# EAGLE design Bodenplatine v001 (EAGLE 7.2.0)
AUTHOR: Stefan Müller; PROJEKTNAME: xMZ-Mod-Touch-Bodenplatine; VERSION: 0.0.1
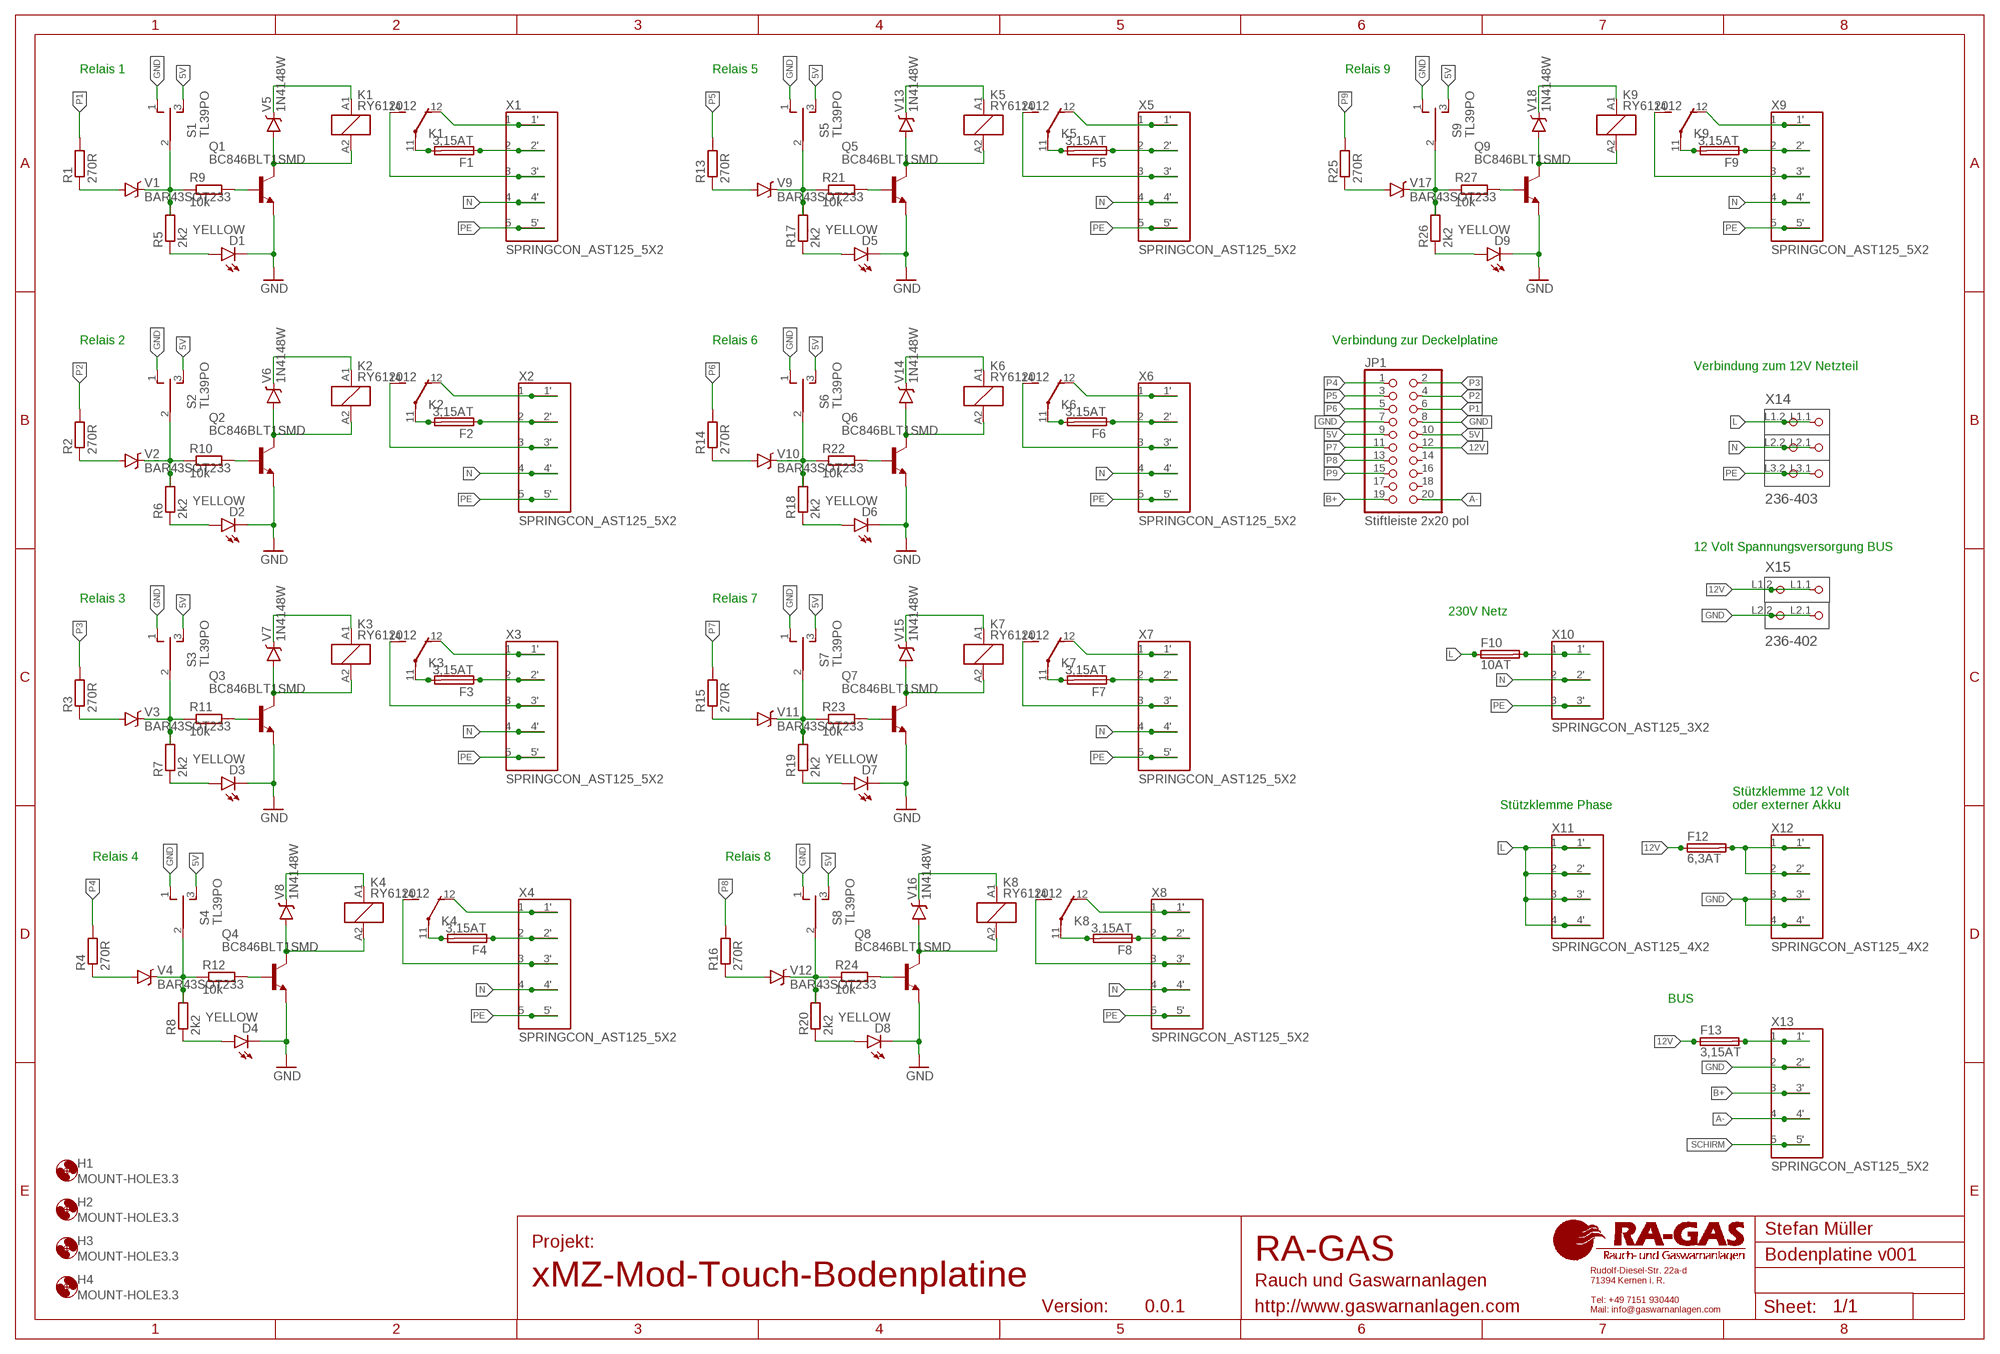
[diagram p0: schematic, sheet 1]

## Parts
D1  YELLOW  LED-YELLOWLARGE  [LED-1206]
D2  YELLOW  LED-YELLOWLARGE  [LED-1206]
D3  YELLOW  LED-YELLOWLARGE  [LED-1206]
D4  YELLOW  LED-YELLOWLARGE  [LED-1206]
D5  YELLOW  LED-YELLOWLARGE  [LED-1206]
D6  YELLOW  LED-YELLOWLARGE  [LED-1206]
D7  YELLOW  LED-YELLOWLARGE  [LED-1206]
D8  YELLOW  LED-YELLOWLARGE  [LED-1206]
D9  YELLOW  LED-YELLOWLARGE  [LED-1206]
F1  3,15AT  FPG4  [FPG4]
F2  3,15AT  FPG4  [FPG4]
F3  3,15AT  FPG4  [FPG4]
F4  3,15AT  FPG4  [FPG4]
F5  3,15AT  FPG4  [FPG4]
F6  3,15AT  FPG4  [FPG4]
F7  3,15AT  FPG4  [FPG4]
F8  3,15AT  FPG4  [FPG4]
F9  3,15AT  FPG4  [FPG4]
F10  10AT  FPG4  [FPG4]
F12  6,3AT  FPG4  [FPG4]
F13  3,15AT  FPG4  [FPG4]
H1  MOUNT-HOLE3.3  [3,3]
H2  MOUNT-HOLE3.3  [3,3]
H3  MOUNT-HOLE3.3  [3,3]
H4  MOUNT-HOLE3.3  [3,3]
JP1  Stiftleiste 2x20 pol  PINHD-2X10  [2X10]
K1  RY612012  [RY-II]
K2  RY612012  [RY-II]
K3  RY612012  [RY-II]
K4  RY612012  [RY-II]
K5  RY612012  [RY-II]
K6  RY612012  [RY-II]
K7  RY612012  [RY-II]
K8  RY612012  [RY-II]
K9  RY612012  [RY-II]
Q1  BC846BLT1SMD  [SOT23]
Q2  BC846BLT1SMD  [SOT23]
Q3  BC846BLT1SMD  [SOT23]
Q4  BC846BLT1SMD  [SOT23]
Q5  BC846BLT1SMD  [SOT23]
Q6  BC846BLT1SMD  [SOT23]
Q7  BC846BLT1SMD  [SOT23]
Q8  BC846BLT1SMD  [SOT23]
Q9  BC846BLT1SMD  [SOT23]
R1  270R  R-EU_M0805  [M0805]
R2  270R  R-EU_M0805  [M0805]
R3  270R  R-EU_M0805  [M0805]
R4  270R  R-EU_M0805  [M0805]
R5  2k2  R-EU_R0603  [R0603]
R6  2k2  R-EU_R0603  [R0603]
R7  2k2  R-EU_R0603  [R0603]
R8  2k2  R-EU_R0603  [R0603]
R9  10k  R-EU_R0603  [R0603]
R10  10k  R-EU_R0603  [R0603]
R11  10k  R-EU_R0603  [R0603]
R12  10k  R-EU_R0603  [R0603]
R13  270R  R-EU_M0805  [M0805]
R14  270R  R-EU_M0805  [M0805]
R15  270R  R-EU_M0805  [M0805]
R16  270R  R-EU_M0805  [M0805]
R17  2k2  R-EU_R0603  [R0603]
R18  2k2  R-EU_R0603  [R0603]
R19  2k2  R-EU_R0603  [R0603]
R20  2k2  R-EU_R0603  [R0603]
R21  10k  R-EU_R0603  [R0603]
R22  10k  R-EU_R0603  [R0603]
R23  10k  R-EU_R0603  [R0603]
R24  10k  R-EU_R0603  [R0603]
R25  270R  R-EU_M0805  [M0805]
R26  2k2  R-EU_R0603  [R0603]
R27  10k  R-EU_R0603  [R0603]
S1  TL39PO  [TL3XPO]
S2  TL39PO  [TL3XPO]
S3  TL39PO  [TL3XPO]
S4  TL39PO  [TL3XPO]
S5  TL39PO  [TL3XPO]
S6  TL39PO  [TL3XPO]
S7  TL39PO  [TL3XPO]
S8  TL39PO  [TL3XPO]
S9  TL39PO  [TL3XPO]
V1  BAR43SOT233  [SOT23]
V2  BAR43SOT233  [SOT23]
V3  BAR43SOT233  [SOT23]
V4  BAR43SOT233  [SOT23]
V5  1N4148W  LL4148  [MINIMELF]
V6  1N4148W  LL4148  [MINIMELF]
V7  1N4148W  LL4148  [MINIMELF]
V8  1N4148W  LL4148  [MINIMELF]
V9  BAR43SOT233  [SOT23]
V10  BAR43SOT233  [SOT23]
V11  BAR43SOT233  [SOT23]
V12  BAR43SOT233  [SOT23]
V13  1N4148W  LL4148  [MINIMELF]
V14  1N4148W  LL4148  [MINIMELF]
V15  1N4148W  LL4148  [MINIMELF]
V16  1N4148W  LL4148  [MINIMELF]
V17  BAR43SOT233  [SOT23]
V18  1N4148W  LL4148  [MINIMELF]
X1  SPRINGCON_AST125_5X2  [SPRINGCON_AST125_5X2]
X2  SPRINGCON_AST125_5X2  [SPRINGCON_AST125_5X2]
X3  SPRINGCON_AST125_5X2  [SPRINGCON_AST125_5X2]
X4  SPRINGCON_AST125_5X2  [SPRINGCON_AST125_5X2]
X5  SPRINGCON_AST125_5X2  [SPRINGCON_AST125_5X2]
X6  SPRINGCON_AST125_5X2  [SPRINGCON_AST125_5X2]
X7  SPRINGCON_AST125_5X2  [SPRINGCON_AST125_5X2]
X8  SPRINGCON_AST125_5X2  [SPRINGCON_AST125_5X2]
X9  SPRINGCON_AST125_5X2  [SPRINGCON_AST125_5X2]
X10  SPRINGCON_AST125_3X2  [SPRINGCON_AST125_3X2]
X11  SPRINGCON_AST125_4X2  [SPRINGCON_AST125_4X2]
X12  SPRINGCON_AST125_4X2  [SPRINGCON_AST125_4X2]
X13  SPRINGCON_AST125_5X2  [SPRINGCON_AST125_5X2]
X14  236-403  [P-236-403]
X15  236-402  [P-236-402]

## Nets
5V: JP1.9 JP1.10 S1.3(S) S2.3(S) S3.3(S) S4.3(S) S5.3(S) S6.3(S) S7.3(S) S8.3(S) S9.3(S)
12V: F12.1 F12.1' F13.1 F13.1' JP1.12 X15.L1.1(P1.1) X15.L1.2(P1.2)
A-: JP1.20 X13.4 X13.4'
B+: JP1.19 X13.3 X13.3'
GND: D1.C D2.C D3.C D4.C D5.C D6.C D7.C D8.C D9.C JP1.7 JP1.8 Q1.2(E) Q2.2(E) Q3.2(E) Q4.2(E) Q5.2(E) Q6.2(E) Q7.2(E) Q8.2(E) Q9.2(E) S1.1(O) S2.1(O) S3.1(O) S4.1(O) S5.1(O) S6.1(O) S7.1(O) S8.1(O) S9.1(O) X12.3 X12.3' X12.4 X12.4' X13.2 X13.2' X15.L2.1(P2.1) X15.L2.2(P2.2)
L: F10.1 F10.1' X11.1 X11.1' X11.2 X11.2' X11.3 X11.3' X11.4 X11.4' X14.L1.1(P1.1) X14.L1.2(P1.2)
N: X1.4 X1.4' X2.4 X2.4' X3.4 X3.4' X4.4 X4.4' X5.4 X5.4' X6.4 X6.4' X7.4 X7.4' X8.4 X8.4' X9.4 X9.4' X10.2 X10.2' X14.L2.1(P2.1) X14.L2.2(P2.2)
N$1: F2.1 F2.1' X2.2 X2.2'
N$2: K2.14(2:S) X2.3 X2.3'
N$3: F2.2 F2.2' K2.11(2:P)
N$4: K2.12(2:O) X2.1 X2.1'
N$5: K2.A2 Q2.3(C) V6.A
N$6: K3.14(2:S) X3.3 X3.3'
N$7: R2.1 V2.1(A)
N$8: R6.2 R10.1 S2.2(P) V2.3(C)
N$9: D2.A R6.1
N$10: Q2.1(B) R10.2
N$11: K2.A1 V6.C
N$12: F3.2 F3.2' K3.11(2:P)
N$13: R3.1 V3.1(A)
N$14: R7.2 R11.1 S3.2(P) V3.3(C)
N$15: D3.A R7.1
N$16: Q3.1(B) R11.2
N$17: K3.A1 V7.C
N$18: K3.A2 Q3.3(C) V7.A
N$19: F3.1 F3.1' X3.2 X3.2'
N$20: K3.12(2:O) X3.1 X3.1'
N$21: K4.14(2:S) X4.3 X4.3'
N$22: F4.2 F4.2' K4.11(2:P)
N$23: R4.1 V4.1(A)
N$24: R8.2 R12.1 S4.2(P) V4.3(C)
N$25: D4.A R8.1
N$26: Q4.1(B) R12.2
N$27: K4.A1 V8.C
N$28: K4.A2 Q4.3(C) V8.A
N$29: F4.1 F4.1' X4.2 X4.2'
N$30: K4.12(2:O) X4.1 X4.1'
N$31: K5.14(2:S) X5.3 X5.3'
N$32: F5.2 F5.2' K5.11(2:P)
N$33: R13.1 V9.1(A)
N$34: R17.2 R21.1 S5.2(P) V9.3(C)
N$35: D5.A R17.1
N$36: Q5.1(B) R21.2
N$37: K5.A1 V13.C
N$38: K5.A2 Q5.3(C) V13.A
N$39: F5.1 F5.1' X5.2 X5.2'
N$40: K5.12(2:O) X5.1 X5.1'
N$41: K6.14(2:S) X6.3 X6.3'
N$42: F6.2 F6.2' K6.11(2:P)
N$43: R14.1 V10.1(A)
N$44: R18.2 R22.1 S6.2(P) V10.3(C)
N$45: D6.A R18.1
N$46: Q6.1(B) R22.2
N$47: K6.A1 V14.C
N$48: K6.A2 Q6.3(C) V14.A
N$49: F6.1 F6.1' X6.2 X6.2'
N$50: K6.12(2:O) X6.1 X6.1'
N$51: K7.14(2:S) X7.3 X7.3'
N$52: F7.2 F7.2' K7.11(2:P)
N$53: R15.1 V11.1(A)
N$54: R19.2 R23.1 S7.2(P) V11.3(C)
N$55: D7.A R19.1
N$56: Q7.1(B) R23.2
N$57: K7.A1 V15.C
N$58: K7.A2 Q7.3(C) V15.A
N$59: F7.1 F7.1' X7.2 X7.2'
N$60: K7.12(2:O) X7.1 X7.1'
N$61: K8.14(2:S) X8.3 X8.3'
N$62: F8.2 F8.2' K8.11(2:P)
N$63: R16.1 V12.1(A)
N$64: R20.2 R24.1 S8.2(P) V12.3(C)
N$65: D8.A R20.1
N$66: Q8.1(B) R24.2
N$67: K8.A1 V16.C
N$68: K8.A2 Q8.3(C) V16.A
N$69: F8.1 F8.1' X8.2 X8.2'
N$70: K8.12(2:O) X8.1 X8.1'
N$71: K9.14(2:S) X9.3 X9.3'
N$72: F9.2 F9.2' K9.11(2:P)
N$73: R25.1 V17.1(A)
N$74: R26.2 R27.1 S9.2(P) V17.3(C)
N$75: D9.A R26.1
N$76: Q9.1(B) R27.2
N$77: K9.A1 V18.C
N$78: K9.A2 Q9.3(C) V18.A
N$79: F9.1 F9.1' X9.2 X9.2'
N$80: K9.12(2:O) X9.1 X9.1'
N$81: K1.14(2:S) X1.3 X1.3'
N$82: F1.2 F1.2' K1.11(2:P)
N$83: R1.1 V1.1(A)
N$84: R5.2 R9.1 S1.2(P) V1.3(C)
N$85: D1.A R5.1
N$86: Q1.1(B) R9.2
N$87: K1.A1 V5.C
N$88: K1.A2 Q1.3(C) V5.A
N$89: F1.1 F1.1' X1.2 X1.2'
N$90: K1.12(2:O) X1.1 X1.1'
N$91: F10.2 F10.2' X10.1 X10.1'
N$92: F13.2 F13.2' X13.1 X13.1'
N$94: F12.2 F12.2' X12.1 X12.1' X12.2 X12.2'
P1: JP1.6 R1.2
P2: JP1.4 R2.2
P3: JP1.2 R3.2
P4: JP1.1 R4.2
P5: JP1.3 R13.2
P6: JP1.5 R14.2
P7: JP1.11 R15.2
P8: JP1.13 R16.2
P9: JP1.15 R25.2
PE: X1.5 X1.5' X2.5 X2.5' X3.5 X3.5' X4.5 X4.5' X5.5 X5.5' X6.5 X6.5' X7.5 X7.5' X8.5 X8.5' X9.5 X9.5' X10.3 X10.3' X14.L3.1(P3.1) X14.L3.2(P3.2)
SCHIRM: X13.5 X13.5'
Unconnected: JP1.14 JP1.16 JP1.17 JP1.18

## Notes on the sheet
- Relais 1 | Relais 5 | Relais 9
- Relais 2 | Relais 6 | Verbindung zur Deckelplatine
- Verbindung zum 12V Netzteil
- 12 Volt Spannungsversorgung BUS
- Relais 3 | Relais 7
- 230V Netz
- Stützklemme Phase
- Stützklemme 12 Volt
  oder externer Akku
- Relais 4 | Relais 8
- BUS

## Library data of the parts
D1-D9 = xMZ-Mod-Touch-Bodenplatine:LED-YELLOW: Yellow SMD LEDs LilyPad 1206- DIO-09909 0603- DIO-09003 "SMART" means more efficient and expensive; MF: KINGBRIGHT; MPN: KP-3216SYC; OC_FARNELL: 8529990; PROD_ID: DIO-00820
F1-F10 F12 F13 = xMZ-Mod-Touch-Bodenplatine:FPG4: PL FPG4-40 :: Sicherungshalter, 5x20mm, max. 10A-250V http://www.reichelt.de/PL-FPG4-40/3/index.html?&ACTION=3&LA=446&ARTICLE=35193&artnr=PL+FPG4-40&SEARCH=PL+FPG+4-40 Datenblatt <http://www.reichelt.de/index.html?&ACTION=7&LA=3&OPEN=0&INDEX=0&FILENAME=C400%252FPL_PFG_4-40.pdf>; OC_FARNELL: unknown; REICHELT: PL+FPG4-40
H1-H4 = holes:MOUNT-HOLE: MOUNTING HOLE with drill center marker; OC_FARNELL: unknown
JP1 = pinhead:PINHD-2X10: PIN HEADER; MF: TE CONNECTIVITY / AMP; MPN: 825440-5; OC_FARNELL: 3417773
K1-K9 = xMZ-Mod-Touch-Bodenplatine:RY?1*: Miniature Power PCB Relay SCHRACK 1 pole 8 A Source: http://www.schrack.com/.. 5817.pdf; MF: TE CONNECTIVITY / SCHRACK; MPN: V23061B1005A301; OC_FARNELL: 1023958; OC_NEWARK: 96B4867
Q1-Q9 = xMZ-Mod-Touch-Bodenplatine:BC846*: NPN Transistor; MF: ON SEMICONDUCTOR; MPN: BC846BWT1G; OC_FARNELL: 2317836
R1-R4 R13-R16 R25 = rcl:R-EU_: RESISTOR, European symbol; MF: MULTICOMP; MPN: MC01W08055270R; OC_FARNELL: 9334254
R5-R8 R17-R20 R26 = rcl:R-EU_: RESISTOR, European symbol; MF: MULTICOMP; MPN: MC0063W060352K2; OC_FARNELL: 9331913
R9-R12 R21-R24 R27 = rcl:R-EU_: RESISTOR, European symbol; MF: TE CONNECTIVITY / NEOHM; MPN: CPF0603B10KE1; OC_FARNELL: 1697388
S1-S9 = xMZ-Mod-Touch-Bodenplatine:TL39PO: TINY SWITCH ON OFF ON Source: http://www2.produktinfo.conrad.com/datenblaetter/700000-724999/705152-da-01-de-Subminiaturschalter_TL_36YO.pdf; MF: TE CONNECTIVITY / ALCOSWITCH; MPN: A103SYCQ04; OC_FARNELL: 1818222
V1-V4 V9-V12 V17 = xMZ-Mod-Touch-Bodenplatine:BAR43: FAIRCHILD SEMICONDUCTOR BAR43 Kleinsignal-Schottky-Diode, Einfach, 30 V, 200 mA, 800 mV, 750 mA, 150 °C Supplier http://de.farnell.com <http://de.farnell.com/fairchild-semiconductor/bar43/schottky-diode-30v-sot-23-3/dp/2453275?ost=2453275&selectedCategoryId=&categoryName=Alle+Kategorien&categoryNameResp=Alle+Kategorien> Datasheet <http://www.farnell.com/datasheets/1963228.pdf> Order Number Supplier 2453275 Farnell; MF: FAIRCHILD SEMICONDUCTOR; MPN: BAR43
V5-V8 V13-V16 V18 = xMZ-Mod-Touch-Bodenplatine:LL4148: VISHAY LL4148-GS08 Kleinsignaldiode, Einfach, 100 V, 150 mA, 1 V, 8 ns, 2 A Datasheet <http://www.farnell.com/datasheets/1353494.pdf> Order Number Supplier 1469399 Farnell 9549986 Farnell 2409162 Farnell 9549986RL Farnell 1469399RL Farnell; MF: VISHAY; MPN: LL4148-GS08; OC_FARNELL: 9549986
X1-X9 X13 = xMZ-Mod-Touch-Bodenplatine:SPRINGCON_AST125_5X2; OC_FARNELL: unknown
X10 = xMZ-Mod-Touch-Bodenplatine:SPRINGCON_AST125_3X2; OC_FARNELL: unknown
X11 X12 = xMZ-Mod-Touch-Bodenplatine:SPRINGCON_AST125_4X2; OC_FARNELL: unknown
X14 = xMZ-Mod-Touch-Bodenplatine:236-403: Serie 236, Klemmenleiste für Leiterplatten 2 Lötstifte/Pol / Series 236, PCB terminal strip 2 solder pins/pole Polzahl / Pole No.: 3 Rastermaß / Pitch: 5 - 5.08 mm Bemessungsspannung / Rated Voltage: 320 V Nennstrom / Nominal Current: 24 A Leiterquerschnitt / Conductor Size: 0.08 - 2.5 mm2 Anschlusstechnik / Connection Technology: CAGE CLAMP® Lötstiftlänge: / Solder Pin Length: 4 mm Leitereinführung (zur Platine) / Conductor entry angle (to PCB): 45 ° Farbe / Color: grau / gray Stand: 01.01.2014. Die jeweils aktuellen Daten zu diesem Artikel finden Sie in unserem Produktkatalog, den Sie unter www.wago.com einsehen können. As of: 01/01/2014. Please find the newest data for this article in our product catalogue, which can be viewed under www.wago.com.; MF: WAGO; MPN: 236-403; OC_FARNELL: 1283527
X15 = xMZ-Mod-Touch-Bodenplatine:236-402: Serie 236, Klemmenleiste für Leiterplatten 2 Lötstifte/Pol / Series 236, PCB terminal strip 2 solder pins/pole Polzahl / Pole No.: 2 Rastermaß / Pitch: 5 - 5.08 mm Bemessungsspannung / Rated Voltage: 320 V Nennstrom / Nominal Current: 24 A Leiterquerschnitt / Conductor Size: 0.08 - 2.5 mm2 Anschlusstechnik / Connection Technology: CAGE CLAMP® Lötstiftlänge: / Solder Pin Length: 4 mm Leitereinführung (zur Platine) / Conductor entry angle (to PCB): 45 ° Farbe / Color: grau / gray Stand: 01.01.2014. Die jeweils aktuellen Daten zu diesem Artikel finden Sie in unserem Produktkatalog, den Sie unter www.wago.com einsehen können. As of: 01/01/2014. Please find the newest data for this article in our product catalogue, which can be viewed under www.wago.com.; MF: WAGO; MPN: 236-402; OC_FARNELL: 1283526

## Board
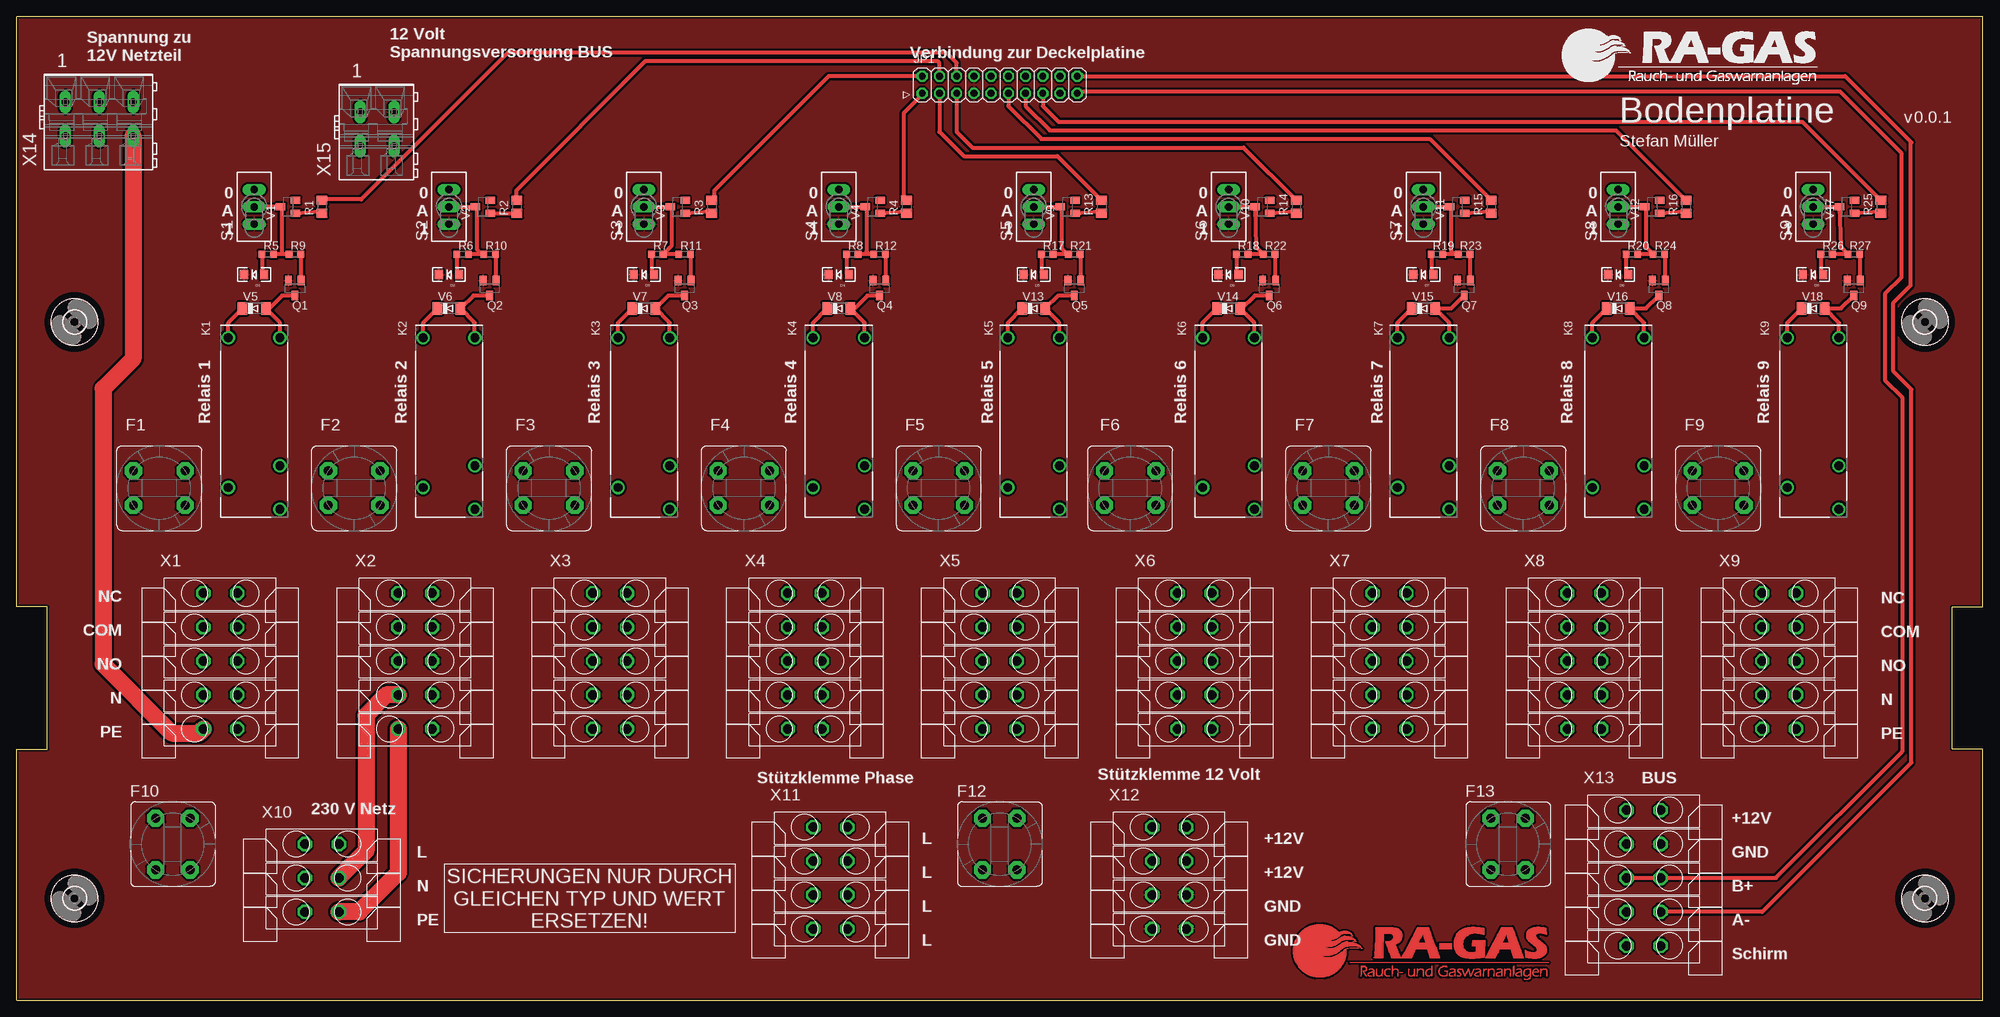
[diagram p1: board, top side]
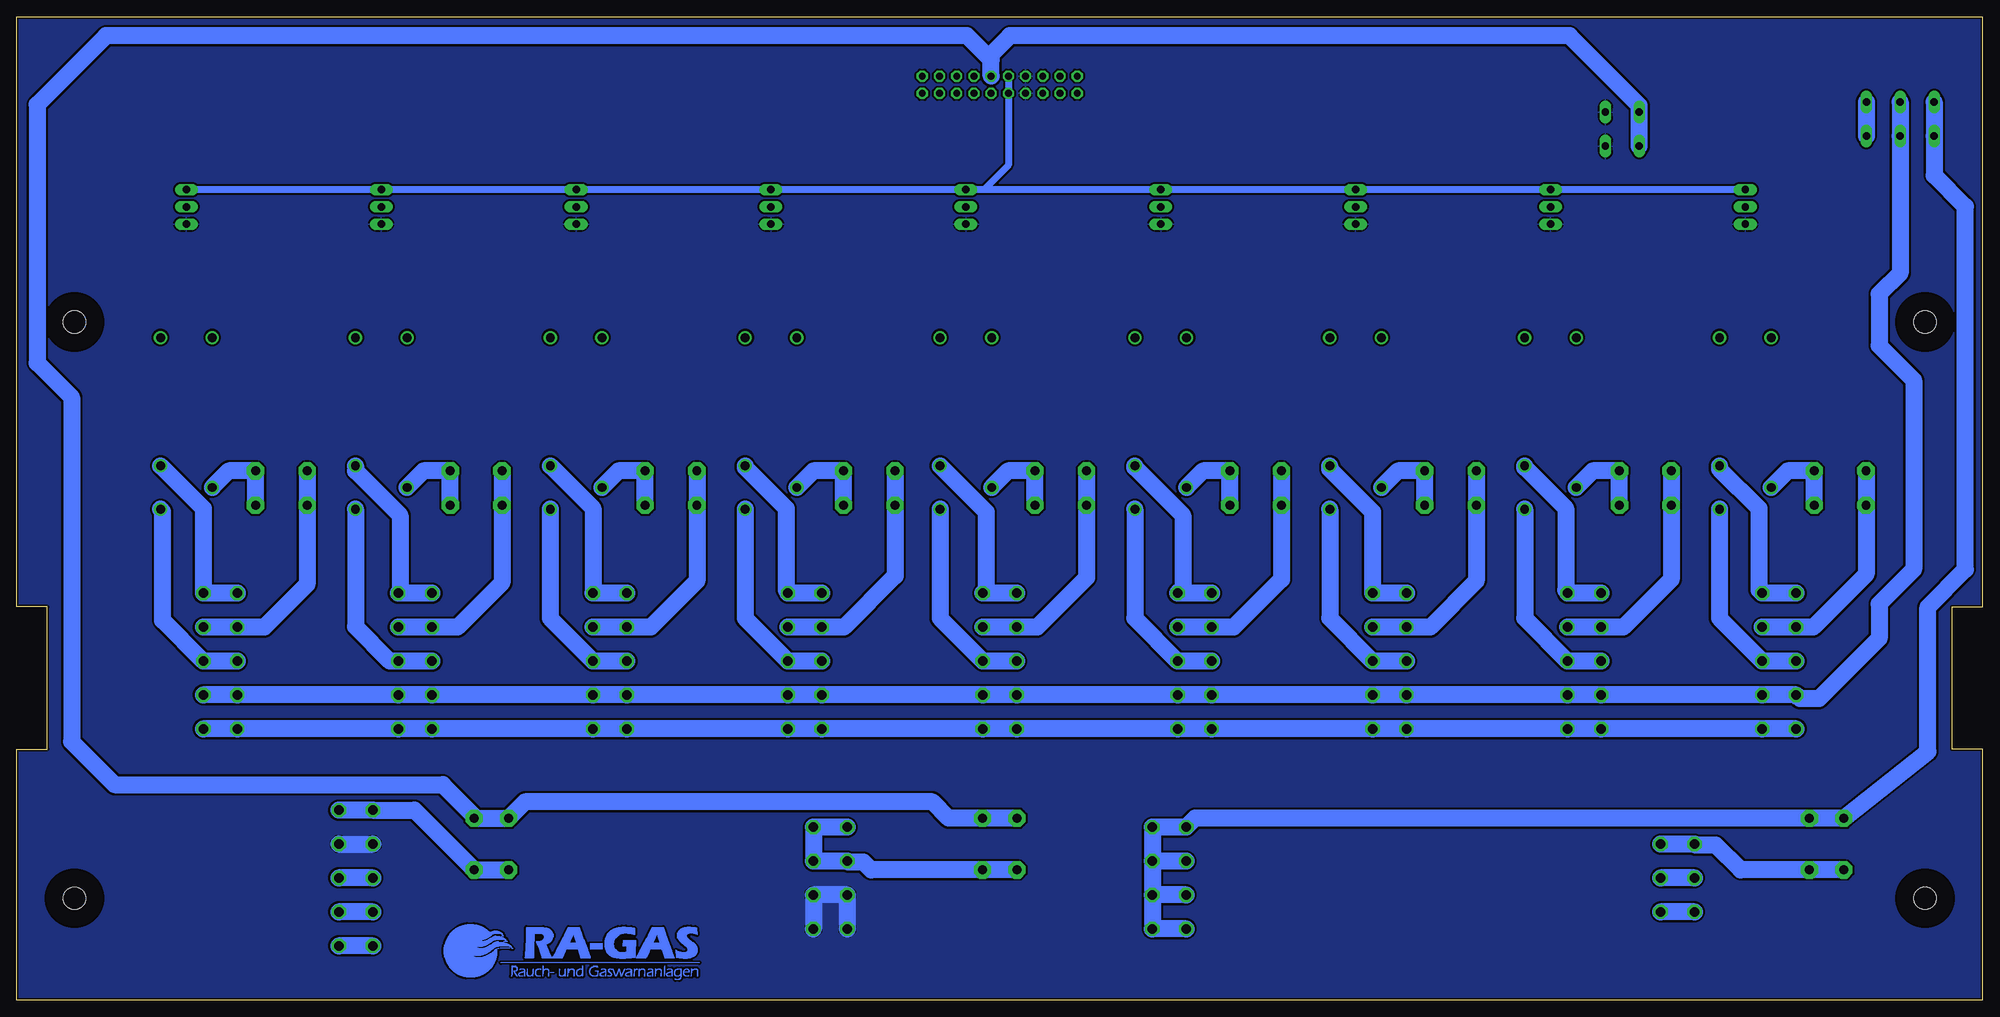
[diagram p2: board, bottom side, seen from below]

Size 290 x 145 mm. Coordinates in mm from the lower left corner, seen from the top.
Outline: 0,0 290,0 290,37 285.5,37 285.5,58 290,58 290,145 0,145 0,58 4.5,58 4.5,37 0,37 0,0
Copper layers (1*16): Top 0.035mm / dielectric 1.5mm / Bottom 0.035mm
Design rules "SparkFun-2-layer": minimum track width 7mil, minimum drill 15mil, track to track 8mil, track to pad 8mil, pad to pad 8mil, via to via 8mil, smd to smd 8mil, copper to edge 8mil, drill to drill 8mil, minimum pad ring 12mil, minimum via ring 10mil, stop-mask expansion 4mil, vias tented up to drill 20mil, thermal gap 10mil

### Footprints (pad centres in the part's own frame; a part is rotated, then mirrored left to right if it is on the bottom)
LED-1206 = smd 1.2 x 1.4: A -1.5,0; C 1.5,0
FPG4 = drill 1.321 pad 2.54 octagon: 1 -2.54,3.81; 1' 2.54,3.81; 2 -2.54,-3.81; 2' 2.54,-3.81
3,3 = hole 3.3: 0,0
2X10 = drill 1.016 octagon: 1 -11.43,-1.27; 2 -11.43,1.27; 3 -8.89,-1.27; 4 -8.89,1.27; 5 -6.35,-1.27; 6 -6.35,1.27; 7 -3.81,-1.27; 8 -3.81,1.27; 9 -1.27,-1.27; 10 -1.27,1.27; 11 1.27,-1.27; 12 1.27,1.27; 13 3.81,-1.27; 14 3.81,1.27; 15 6.35,-1.27; 16 6.35,1.27; 17 8.89,-1.27; 18 8.89,1.27; 19 11.43,-1.27; 20 11.43,1.27
RY-II = drill 1.3: 11 9.4,-3.81; 12 6.2,3.81; 14 12.6,3.81; A1 -12.7,-3.81; A2 -12.7,3.81
SOT23 = smd 1 x 1.4: 1 -0.95,-1.1; 2 0.95,-1.1; 3 0,1.1
M0805 = smd 1.3 x 1.6: 1 -0.95,0; 2 0.95,0
R0603 = smd 1 x 1.1: 1 -0.85,0; 2 0.85,0
TL3XPO = drill 1.1 pad 1.422 long: 1 -2.54,0; 2 0,0; 3 2.54,0
MINIMELF = smd 1.4 x 1.8: A 1.7,0; C -1.7,0
SPRINGCON_AST125_5X2 = drill 1.4 octagon: 1 -2.5,10; 1' 2.5,10; 2 -2.5,5; 2' 2.5,5; 3 -2.5,0; 3' 2.5,0; 4 -2.5,-5; 4' 2.5,-5; 5 -2.5,-10; 5' 2.5,-10
SPRINGCON_AST125_3X2 = drill 1.4 octagon: 1 -2.5,5; 1' 2.5,5; 2 -2.5,0; 2' 2.5,0; 3 -2.5,-5; 3' 2.5,-5
SPRINGCON_AST125_4X2 = drill 1.4 octagon: 1 -2.5,7.5; 1' 2.5,7.5; 2 -2.5,2.5; 2' 2.5,2.5; 3 -2.5,-2.5; 3' 2.5,-2.5; 4 -2.5,-7.5; 4' 2.5,-7.5
P-236-403 = drill 1.1 long: L1.1 2.957,4.85; L1.2 -2.043,4.85; L2.1 2.957,-0.15; L2.2 -2.043,-0.15; L3.1 2.957,-5.15; L3.2 -2.043,-5.15
P-236-402 = drill 1.1 long: L1.1 2.957,2.35; L1.2 -2.043,2.35; L2.1 2.957,-2.65; L2.2 -2.043,-2.65

### Placement (x,y rotation side)
D1  35,107 180 top
D2  63.75,107 180 top
D3  92.5,107 180 top
D4  121.25,107 180 top
D5  150,107 180 top
D6  178.75,107 180 top
D7  207.5,107 180 top
D8  236.25,107 180 top
D9  265,107 180 top
F1  21,75.5 90 top
F2  49.75,75.5 90 top
F3  78.5,75.5 90 top
F4  107.25,75.5 90 top
F5  136,75.5 90 top
F6  164.25,75.5 90 top
F7  193.5,75.5 90 top
F8  222.25,75.5 90 top
F9  251,75.5 90 top
F10  23,23 0 top
F12  145,23 0 top
F13  220,23 0 top
H1  8.5,100 0 top
H2  281.5,100 0 top
H3  281.5,15 0 top
H4  8.5,15 0 top
JP1  145,135 0 top
K1  35,85 270 top
K2  63.75,85 270 top
K3  92.5,85 270 top
K4  121.25,85 270 top
K5  150,85 270 top
K6  178.75,85 270 top
K7  207.5,85 270 top
K8  236.25,85 270 top
K9  265,85 270 top
Q1  41,105 180 top
Q2  69.75,105 180 top
Q3  98.5,105 180 top
Q4  127.25,105 180 top
Q5  156,105 180 top
Q6  184.75,105 180 top
Q7  213.5,105 180 top
Q8  242.25,105 180 top
Q9  271,105 180 top
R1  45,117 90 top
R2  73.75,117 90 top
R3  102.5,117 90 top
R4  131.25,117 90 top
R5  37,110 0 top
R6  65.75,110 0 top
R7  94.5,110 0 top
R8  123.25,110 0 top
R9  41,110 0 top
R10  69.75,110 0 top
R11  98.5,110 0 top
R12  127.25,110 0 top
R13  160,117 90 top
R14  188.75,117 90 top
R15  217.5,117 90 top
R16  246.25,117 90 top
R17  152,110 0 top
R18  180.75,110 0 top
R19  209.5,110 0 top
R20  238.25,110 0 top
R21  156,110 0 top
R22  184.75,110 0 top
R23  213.5,110 0 top
R24  242.25,110 0 top
R25  275,117 90 top
R26  267,110 0 top
R27  271,110 0 top
S1  35,117 90 top
S2  63.75,117 90 top
S3  92.5,117 90 top
S4  121.25,117 90 top
S5  150,117 90 top
S6  178.75,117 90 top
S7  207.5,117 90 top
S8  236.25,117 90 top
S9  265,117 90 top
U$1  [TEXT_FUSE]  84.5,15 0 top
U$2  [TEXT_NAME_VERSION_AUTHOR]  236.39,125.88 0 top
U$3  [LOGO_RA-GAS]  227.33,134.62 0 top
U$4  [LOGO_RA-GAS_BOTTOM]  187.96,2.54 0 top
U$5  [LOGO_RA-GAS_BOTTOM]  227.33,2.54 0 bottom
V1  40,117 90 top
V2  68.75,117 90 top
V3  97.5,117 90 top
V4  126.25,117 90 top
V5  35,102 0 top
V6  63.75,102 0 top
V7  92.5,102 0 top
V8  121.25,102 0 top
V9  155,117 90 top
V10  183.75,117 90 top
V11  212.5,117 90 top
V12  241.25,117 90 top
V13  150,102 0 top
V14  178.75,102 0 top
V15  207.5,102 0 top
V16  236.25,102 0 top
V17  270,117 90 top
V18  265,102 0 top
X1  30,50 0 top
X2  58.75,50 0 top
X3  87.5,50 0 top
X4  116.25,50 0 top
X5  145,50 0 top
X6  173.75,50 0 top
X7  202.5,50 0 top
X8  231.25,50 0 top
X9  260,50 0 top
X10  45,18 0 top
X11  120,18 0 top
X12  170,18 0 top
X13  240,18 0 top
X14  12,129.5 90 top
X15  53,128 90 top

### Tracks (layer width: path | path; a pad name or v marks a point on that pad's centre or on a via)
5V
  Bottom 1.016: 147.32,119.54 S4.3 S3.3 S2.3 S1.3 | 147.32,119.54 S5.3 S6.3 S7.3 S8.3 S9.3 | JP1.10 JP1.9 143.73,123.13 147.32,119.54
12V
  Bottom 2.54: F12.1 F12.1' 152.54,26.81 154.94,29.21 215.06,29.21 F13.1 222.25,26.81 | F13.1' 222.25,26.81 | JP1.12 146.27,138.65 146.69,139.06 | 146.69,139.06 149.86,142.24 276.86,142.24 287.02,132.08 287.02,93.98 281.94,88.9 281.94,38.1 275.59,31.75 227.19,31.75 222.25,26.81 | X15.L1.2 X15.L1.1 50.65,131.93 60.96,142.24 143.51,142.24 146.69,139.06
A-
  Top 0.61: JP1.20 269.73,136.27 279.5,126.5 279.4,126.4 279.4,105.41 276.86,102.87 276.86,92.71 279.5,90.07 279.5,35 257.5,13 X13.4'
  Bottom 2.54: X13.4 X13.4'
B+
  Top 0.61: X13.3 259.5,18 278.13,36.63 278.13,88.9 275.59,91.44 275.59,104.14 278,106.55 278,125 269,134 156.7,134
  Top 1.016: 156.7,134 JP1.19
  Bottom 2.54: X13.3 X13.3'
GND
  Bottom 1.016: X15.L2.2 55.46,125.96
  Bottom 2.54: X12.4 X12.3 X12.3' X12.4' | X13.2' X13.2
  pour Bottom (isolate 0.305): 0,0 0,145 290,145 290,0
  pour Top (isolate 0.305): 0,0 0,145 290,145 290,0
L
  Bottom 2.54: X11.4 X11.4' X11.3' | X11.3 X11.3' | X11.2 X11.2' | X11.2' X11.1' X11.1 116.19,26.81 F10.1' F10.1 8.08,36.65 8.08,57.96 2.54,63.5 2.54,117.04 7.15,121.65 X14.L1.2 X14.L1.1 | X11.2' X11.3'
N
  Top 2.54: X2.4 54.5,45 51.5,42 51.5,22 X10.2'
  Bottom 2.54: X10.2 X10.2' | X9.4' X9.4 X8.4' X8.4 X7.4' X7.4 X6.4' X6.4 X5.4' X5.4 X4.4' X4.4 X3.4' X3.4 X2.4' X2.4 X1.4' X1.4 26.95,44.45 24.13,44.45 15.24,53.34 15.24,58.42 10.16,63.5 10.16,91.44 15.24,96.52 15.24,104.14 12.15,107.23 X14.L2.2 X14.L2.1
N$1
  Bottom 2.54: X2.2' 56.5,55 X2.2 53,55 45.94,62.06 F2.1 F2.1'
N$2
  Bottom 2.54: X2.3 X2.3' 67.56,56.31 K2.14
N$3
  Bottom 2.54: F2.2 F2.2' 57.5,78.04 K2.11
N$4
  Bottom 2.54: X2.1 61,60 | 61,60 X2.1' | K2.12 67.56,78.56 61.5,72.5 61.5,60.5 61,60
N$5
  Top 0.61: K2.A2 67.56,99.89 V6.A 67.35,103.9 Q2.3
N$6
  Bottom 2.54: X3.3 X3.3' 96.31,56.31 K3.14
N$7
  Top 0.61: R2.1 73.45,116.35 73.15,116.05 V2.1
N$8
  Top 0.61: R10.1 68.58,110 | 68.58,110 R6.2 | V2.3 67.83,116.84 | 67.83,116.84 67.83,110.75 68.58,110 | S2.2 67.67,117 67.83,116.84
N$9
  Top 0.61: R6.1 64.9,107.35 D2.A
N$10
  Top 0.61: Q2.1 70.7,109.9 R10.2
N$11
  Top 0.61: K2.A1 59.94,99.89 V6.C
N$12
  Bottom 2.54: F3.2 F3.2' 86.25,78.04 K3.11
N$13
  Top 0.61: V3.1 102.2,116.35 R3.1
N$14
  Top 0.61: R11.1 R7.2 96.58,111.22 96.58,116.84 | V3.3 96.58,116.84 | S3.2 96.42,117 96.58,116.84
N$15
  Top 0.61: R7.1 93.65,107.35 D3.A
N$16
  Top 0.61: Q3.1 99.45,109.9 R11.2
N$17
  Top 0.61: K3.A1 88.69,99.89 V7.C
N$18
  Top 0.61: K3.A2 96.31,99.89 V7.A 96.1,103.9 Q3.3
N$19
  Bottom 2.54: X3.2' X3.2 81.5,55 74.69,61.81 F3.1 F3.1'
N$20
  Bottom 2.54: X3.1 X3.1' 90,72 96.31,78.31 K3.12
N$21
  Bottom 2.54: X4.3 X4.3' 125.06,56.31 K4.14
N$22
  Bottom 2.54: F4.2 F4.2' 115,78.04 K4.11
N$23
  Top 0.61: V4.1 130.95,116.35 R4.1
N$24
  Top 0.61: R12.1 125.73,110 | 125.73,110 R8.2 | V4.3 125.33,116.84 | 125.33,116.84 125.33,110.41 125.73,110 | S4.2 125.17,117 125.33,116.84
N$25
  Top 0.61: R8.1 122.4,107.35 D4.A
N$26
  Top 0.61: Q4.1 128.2,109.9 R12.2
N$27
  Top 0.61: K4.A1 117.44,99.89 V8.C
N$28
  Top 0.61: K4.A2 125.06,99.89 123.27,101.68 | 123.27,101.68 V8.A | Q4.3 125.49,103.9 123.27,101.68
N$29
  Bottom 2.54: X4.2' 114,55 X4.2 110.5,55 103.44,62.06 F4.1 F4.1'
N$30
  Bottom 2.54: X4.1 X4.1' 118,60.75 118,71.5 125.06,78.56 K4.12
N$31
  Bottom 2.54: X5.3 X5.3' 153.81,56.31 K5.14
N$32
  Bottom 2.54: F5.2 F5.2' 143.75,78.04 K5.11
N$33
  Top 0.61: V9.1 159.7,116.35 R13.1
N$34
  Top 0.61: R21.1 154.94,110 | 154.94,110 R17.2 | V9.3 154.07,116.84 | 154.07,116.84 154.07,110.86 154.94,110 | S5.2 153.91,117 154.07,116.84
N$35
  Top 0.61: R17.1 151.15,107.35 D5.A
N$36
  Top 0.61: Q5.1 156.95,109.9 R21.2
N$37
  Top 0.61: K5.A1 146.19,99.89 V13.C
N$38
  Top 0.61: K5.A2 153.81,99.89 V13.A 153.6,103.9 Q5.3
N$39
  Bottom 2.54: X5.2' X5.2 139.5,55 132.19,62.31 F5.1 F5.1'
N$40
  Bottom 2.54: X5.1 X5.1' 147,60.5 147,72 K5.12
N$41
  Bottom 2.54: X6.3 X6.3' 182.56,56.31 K6.14
N$42
  Bottom 2.54: F6.2 F6.2' 172.5,78.04 K6.11
N$43
  Top 0.61: V10.1 188.45,116.35 R14.1
N$44
  Top 0.61: R18.2 R22.1 182.82,111.08 V10.3 S6.2
N$45
  Top 0.61: R18.1 179.9,107.35 D6.A
N$46
  Top 0.61: Q6.1 185.7,109.9 R22.2
N$47
  Top 0.61: K6.A1 174.94,99.89 V14.C
N$48
  Top 0.61: K6.A2 182.56,99.89 180.59,101.86 | 180.59,101.86 V14.A | Q6.3 182.64,103.9 180.59,101.86
N$49
  Bottom 2.54: X6.2' X6.2 168,55 160.44,62.56 F6.1 F6.1'
N$50
  Bottom 2.54: X6.1 176,60 | 176,60 X6.1' | K6.12 182.56,78.56 176.5,72.5 176.5,60.5 176,60
N$51
  Bottom 2.54: X7.3 X7.3' 211.31,56.31 K7.14
N$52
  Bottom 2.54: F7.2 F7.2' 201.25,78.04 K7.11
N$53
  Top 0.61: V11.1 217.2,116.35 R15.1
N$54
  Top 0.61: R23.1 212.09,110 | 212.09,110 R19.2 | V11.3 211.57,116.84 | 211.57,116.84 211.57,110.52 212.09,110 | S7.2 211.41,117 211.57,116.84
N$55
  Top 0.61: R19.1 208.65,107.35 D7.A
N$56
  Top 0.61: Q7.1 214.45,109.9 R23.2
N$57
  Top 0.61: K7.A1 203.69,99.89 V15.C
N$58
  Top 0.61: K7.A2 211.31,99.89 V15.A 211.6,102 Q7.3
N$59
  Bottom 2.54: X7.2' X7.2 196.5,55 189.69,61.81 F7.1 F7.1'
N$60
  Bottom 2.54: X7.1 X7.1' 205,72.5 K7.12
N$61
  Bottom 2.54: X8.3 X8.3' 235,50 240.06,55.06 K8.14
N$62
  Bottom 2.54: F8.2 F8.2' 230,78.04 K8.11
N$63
  Top 0.61: V12.1 245.95,116.35 R16.1
N$64
  Top 0.61: R20.2 R24.1 240.32,111.08 240.32,116.84 | V12.3 240.32,116.84 | S8.2 240.16,117 240.32,116.84
N$65
  Top 0.61: R20.1 237.4,107.35 D8.A
N$66
  Top 0.61: Q8.1 243.2,109.9 R24.2
N$67
  Top 0.61: K8.A1 232.44,99.89 V16.C
N$68
  Top 0.61: K8.A2 240.06,99.89 V16.A 240.35,102 Q8.3
N$69
  Bottom 2.54: X8.2' X8.2 225,55 218.44,61.56 F8.1 F8.1'
N$70
  Bottom 2.54: X8.1 X8.1' 233.5,60.25 233.5,71.5 240.06,78.06 K8.12
N$71
  Bottom 2.54: X9.3 X9.3' 268.5,56 268.5,72.09 K9.14
N$72
  Bottom 2.54: F9.2 F9.2' 258.75,78.04 K9.11
N$73
  Top 0.61: V17.1 274.7,116.35 R25.1
N$74
  Top 0.61: R26.2 R27.1 269.07,111.08 V17.3 S9.2
N$75
  Top 0.61: R26.1 266.15,107.35 D9.A
N$76
  Top 0.61: Q9.1 271.95,109.9 R27.2
N$77
  Top 0.61: K9.A1 261.19,99.89 V18.C
N$78
  Top 0.61: K9.A2 268.81,99.89 V18.A 269.1,102 Q9.3
N$79
  Bottom 2.54: X9.2' X9.2 253.5,55 247.19,61.31 F9.1 F9.1'
N$80
  Bottom 2.54: X9.1 X9.1' 262.5,72.5 K9.12
N$81
  Bottom 2.54: X1.3 X1.3' 38.81,56.31 K1.14
N$82
  Bottom 2.54: F1.2 F1.2' 28.75,78.04 K1.11
N$83
  Top 0.61: V1.1 44.7,116.35 R1.1
N$84
  Top 0.61: R9.1 39.37,110 | 39.37,110 R5.2 | V1.3 39.08,116.84 | 39.08,116.84 39.08,110.3 39.37,110 | 39.08,116.84 38.91,117 S1.2
N$85
  Top 0.61: R5.1 36.15,107.35 D1.A
N$86
  Top 0.61: Q1.1 41.95,109.9 R9.2
N$87
  Top 0.61: K1.A1 31.19,99.89 V5.C
N$88
  Top 0.61: K1.A2 38.81,99.89 36.97,101.73 | 36.97,101.73 V5.A | Q1.3 39.13,103.9 36.97,101.73
N$89
  Bottom 2.54: X1.2' X1.2 25,55 17.19,62.81 F1.1 F1.1'
N$90
  Bottom 2.54: X1.1 X1.1' 33,60.5 33,72.5 38.81,78.31 K1.12
N$91
  Bottom 2.54: X10.1' X10.1 42.36,22.86 39.37,22.86 35.7,19.19 F10.2' F10.2
N$92
  Bottom 2.54: X13.1' X13.1 231.35,28 F13.2' F13.2
N$94
  Bottom 2.54: X12.1 X12.1' X12.2' X12.2 167.32,20.32 165.1,20.32 163.97,19.19 F12.2' F12.2
P1
  Top 0.61: JP1.6 138.65,138.21 137.16,139.7 72.39,139.7 50.8,118.11 45.16,118.11 R1.2
P2
  Top 0.61: JP1.4 136.11,138.21 135.89,138.43 92.71,138.43 73.66,119.38 73.66,118.04 R2.2
P3
  Top 0.61: JP1.2 119.76,136.27 102.87,119.38 102.87,118.32 R3.2
P4
  Top 0.61: JP1.1 133.57,133.57 130.81,130.81 130.81,118.39 R4.2
P5
  Top 0.61: JP1.3 136.11,128.05 139.7,124.46 153.49,124.46 R13.2
P6
  Top 0.61: JP1.5 138.65,128.05 140.97,125.73 180.97,125.73 R14.2
P7
  Top 0.61: JP1.11 146.27,131.86 151.13,127 208.45,127 R15.2
P8
  Top 0.61: JP1.13 148.81,131.86 152.4,128.27 235.93,128.27 R16.2
P9
  Top 0.61: JP1.15 151.35,131.86 153.67,129.54 263.41,129.54 R25.2
PE
  Top 2.54: X2.5 56.25,18.75 50.5,13 X10.3' | X14.L3.2 17.15,94.62 12.7,90.17 12.7,49.53 22.86,39.37 26.87,39.37 X1.5
  Bottom 2.54: X1.5 X1.5' X2.5 X2.5' X3.5 X3.5' X4.5 X4.5' X5.5 X5.5' X6.5 X6.5' X7.5 X7.5' X8.5 X8.5' X9.5 X9.5' | X10.3 X10.3' | X14.L3.1 X14.L3.2
SCHIRM
  Bottom 2.54: X13.5 X13.5'

### Text on the board
tPlace: 12 Volt / Spannungsversorgung BUS | Verbindung zur Deckelplatine | Spannung zu / 12V Netzteil | 0 / A / 1 | 0 / A / 1 | 0 / A / 1 | 0 / A / 1 | 0 / A / 1 | 0 / A / 1 | 0 / A / 1 | 0 / A / 1 | 0 / A / 1 | Relais 1 | Relais 2 | Relais 3 | Relais 4 | Relais 5 | Relais 6 | Relais 7 | Relais 8 | Relais 9 | NC | NC | COM | COM | NO | NO | N | N | PE | PE | Stützklemme Phase | Stützklemme 12 Volt | BUS | 230 V Netz | +12V | L | +12V | L | GND | L | +12V | N | B+ | L | GND | PE | A- | L | GND | Schirm